# Altium project bt7.PrjPcb
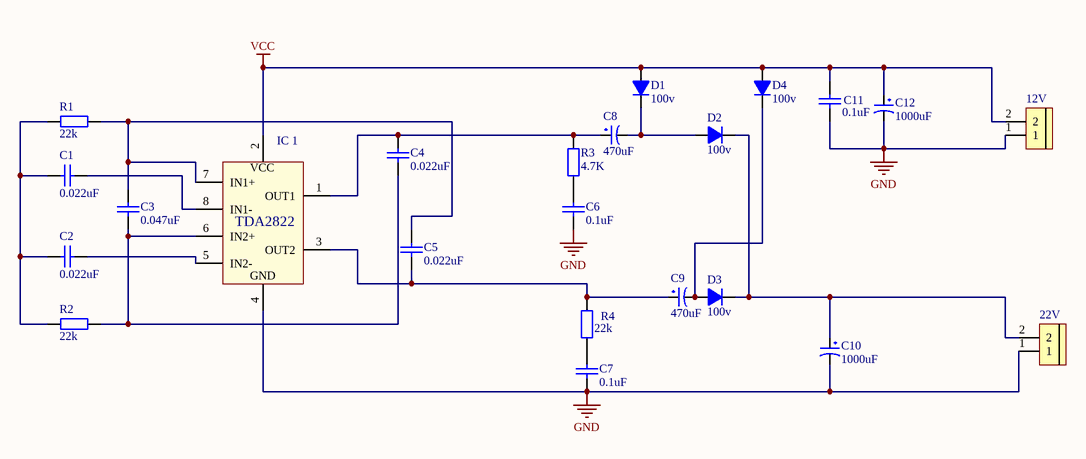
[diagram p0: schematic.SchDoc]
1 sheet, 23 parts. Net scope: global (net labels, ports and power ports of the same name join across sheets).
Board file: PCB.PcbDoc

## Sheet schematic.SchDoc
size A4; SheetNumber: 1; SheetTotal: 1

### Parts
12V  (no value)  [Con 2 KF301 5.08]
22V  (no value)  [Con 2 KF301 5.08]
C1  0.022uF  [tu gom]
C2  0.022uF  [tu gom]
C3  0.047uF  [tu gom]
C4  0.022uF  [tu gom]
C5  0.022uF  [tu gom]
C6  0.1uF  [tu gom]
C7  0.1uF  [tu gom]
C8  470uF  [tu hoa 13mm]
C9  470uF  [tu hoa 13mm]
C10  1000uF  [tu hoa 13mm]
C11  0.1uF  [tu gom]
C12  1000uF  [tu hoa 13mm]
D1  100v  [DIODE 1A]
D2  100v  [DIODE 1A]
D3  100v  [DIODE 1A]
D4  100v  [DIODE 1A]
IC_1  MH001571  [DIP8]  (value not drawn)
R1  22k  [tro vach 1/4w]
R2  22k  [tro vach 1/4w]
R3  4.7K  [tro vach 1/4w]
R4  22k  [tro vach 1/4w]

### Nets
GND: 12V.1 22V.1 C6.2 C7.2 C10.2 C11.2 C12.2 IC_1.4(GND)
VCC: 12V.2 C11.1 C12.1 D1.1(A) D4.1(A) IC_1.2(VCC)
Net22V_2: 22V.2 C10.1 D2.2(K) D3.2(K)
NetC1_1: C1.1 IC_1.8(IN1-)
NetC1_2: C1.2 C2.2 R1.1 R2.1
NetC2_1: C2.1 IC_1.5(IN2-)
NetC3_1: C3.1 C4.2 IC_1.6(IN2+) R2.2
NetC3_2: C3.2 C5.1 IC_1.7(IN1+) R1.2
NetC4_1: C4.1 C8.1 IC_1.1(OUT1) R3.2
NetC5_2: C5.2 C9.1 IC_1.3(OUT2) R4.2
NetC6_1: C6.1 R3.1
NetC7_1: C7.1 R4.1
NetC8_2: C8.2 D1.2(K) D2.1(A)
NetC9_2: C9.2 D3.1(A) D4.2(K)

### Notes on the sheet
- (in symbol TDA2822 DIP) TDA2822

### Library data of the parts
12V 22V = CON 2 KF301: Cắm; Ma_Hang: MH000987; Ten_Linh_Kien: CON 2 KF301-2P 5.08MM Xanh Dương; Don_Vi: Con; Chung_Loai: Cắm; Ghi_Chu: *; Kieu_Chan: *
C1-C7 C11 = Tu gom 104 50V: Cắm; So_Chan: 2; Ten_Linh_Kien: Tụ gốm 104 100nF 50V; Don_Vi: Con; Ma_Hang: MH004761; Chung_Loai: Cắm; Kieu_Chan: *
C8-C10 C12 = Tu Hoa 1000uF 50V 13x26: Cắm; Don_Vi: Con; So_Chan: 2; Ten_Linh_Kien: Tụ Hóa 1000uF 50V; Ma_Hang: MH006619; Chung_Loai: Cắm; Kieu_Chan: *
D1-D4 = Diode 1N4007: Cắm; Ten_Linh_Kien: Diode 1N4007 1A (DIP); Don_Vi: Con; Ma_Hang: MH001063; Ghi Chu: *; Kieu_Chan: *; Chung_Loai: Cắm
IC_1 = TDA2822 DIP: Cắm; Value: TDA2822 12V
R1-R4 = Tro Vach 1/4W 5% 22k: Cắm; Don_Vi: Con; So_Chan: 2; Ten_Linh_Kien: Trở Vạch 1/4w 5% 22k; Ma_Hang: MH007301; Chung_Loai: Cắm; Kieu_Chan: *